# Altium schematic sheet MicroSD.SchDoc
size A; SheetNumber: 4; SheetTotal: 8
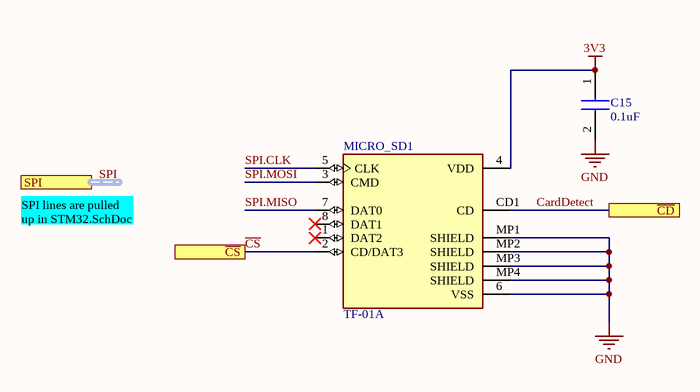
[diagram p0: MicroSD.SchDoc]

## Parts
C15  value 0.1uF  [CAPC1005X55N]  (hidden comment: 0.1uF Ceramic Capacitor)
MICRO_SD1  TF-01A  [TF-01A]

## Ports
SPI (harness SPI, see STM32[1D]), ~{CD} (see STM32[1D]), ~{CS} (see STM32[1D])

## Nets
3V3: C15.1 MICRO_SD1.4(VDD)
GND: C15.2 MICRO_SD1.6(VSS) MICRO_SD1.MP1(SHIELD) MICRO_SD1.MP2(SHIELD) MICRO_SD1.MP3(SHIELD) MICRO_SD1.MP4(SHIELD)
~{CS}: MICRO_SD1.2(CD/DAT3) ; port ~{CS}
CardDetect: MICRO_SD1.CD1(CD) ; port ~{CD}
SPI.CLK: MICRO_SD1.5(CLK)
SPI.MISO: MICRO_SD1.7(DAT0)
SPI.MOSI: MICRO_SD1.3(CMD)

Not connected (* = marked no-connect by the designer): MICRO_SD1 1(DAT2)* 8(DAT1)*

## Buses and harness runs
harness SPI = port SPI

## Notes on the sheet
- SPI lines are pulled up in STM32.SchDoc

## Library data of the parts
C15 = CL05B104KO5NNNC: Manufacturer_Name: SAMSUNG; Datasheet Link: https://datasheet.datasheetarchive.com/originals/distributors/Datasheets-DGA10/2408147.pdf; Height: 0.55mm; Manufacturer_Part_Number: CL05B104KO5NNNC; Mouser Part Number: 187-CL05B104KO5NNNC; Mouser Price/Stock: https://www.mouser.co.uk/ProductDetail/Samsung-Electro-Mechanics/CL05B104KO5NNNC?qs=hqM3L16%252BxlfT2SKOuAUq6Q%3D%3D; Arrow Part Number: CL05B104KO5NNNC; Arrow Price/Stock: https://www.arrow.com/en/products/cl05b104ko5nnnc/samsung-electro-mechanics?utm_currency=USD&region=europe
MICRO_SD1 = TF-01A: Standard Card Edge Connectors; MF: HRO Electronics Co., Ltd.; Price: None; Availability: Not in stock; MP: TF-01A; Package: Package; SnapEDA_Link: https://www.snapeda.com/parts/TF-01A/HRO+Electronics+Co.%252C+Ltd./view-part/?ref=snap; Check_prices: https://www.snapeda.com/parts/TF-01A/HRO+Electronics+Co.%252C+Ltd./view-part/?ref=eda; Value: *